# EAGLE schematic LaserScanner (EAGLE 9.1.3)
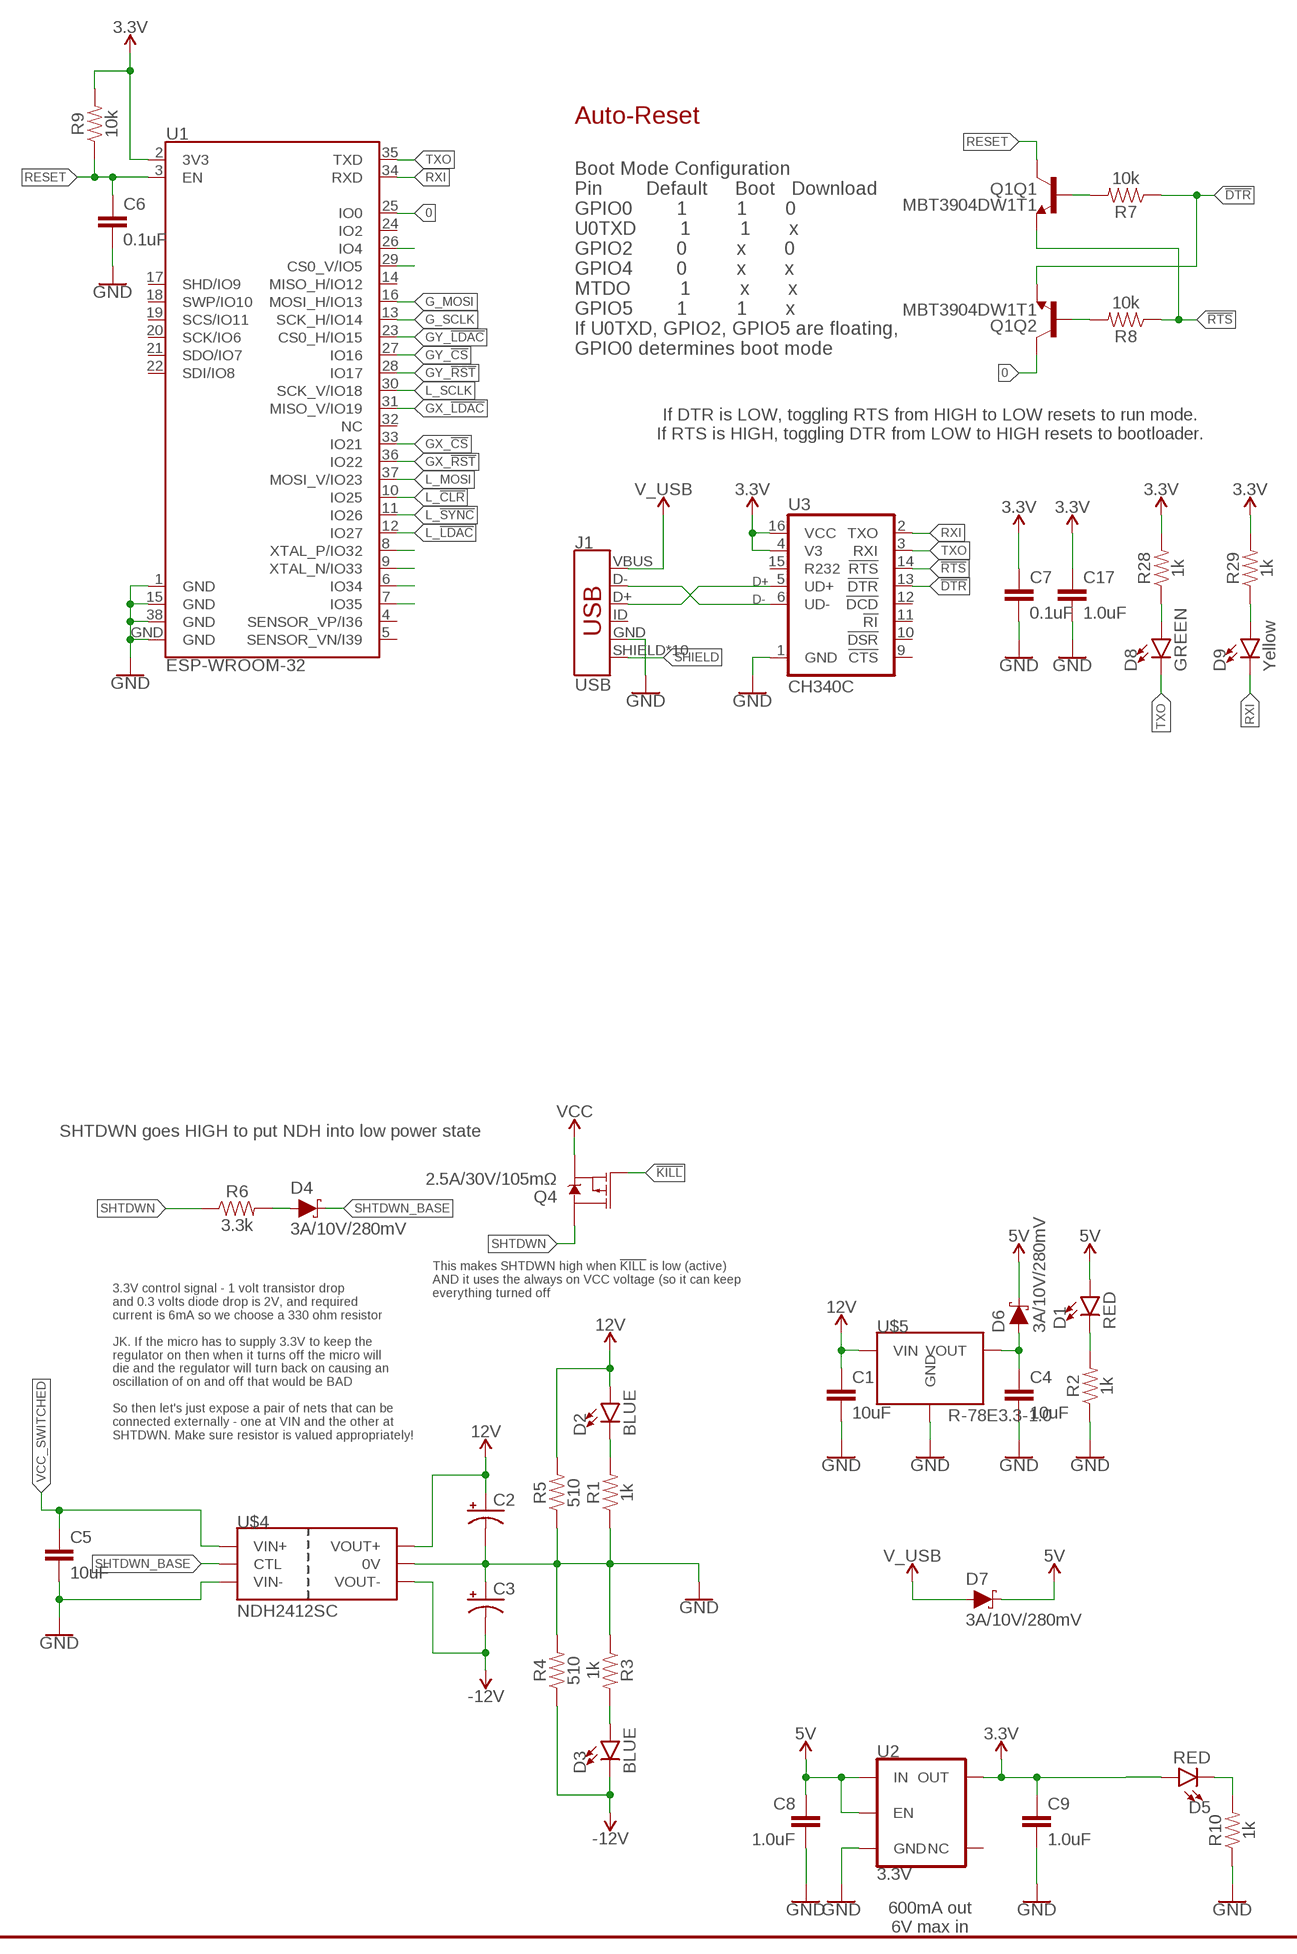
[diagram p0: schematic, sheet 1, part 1 of 2]
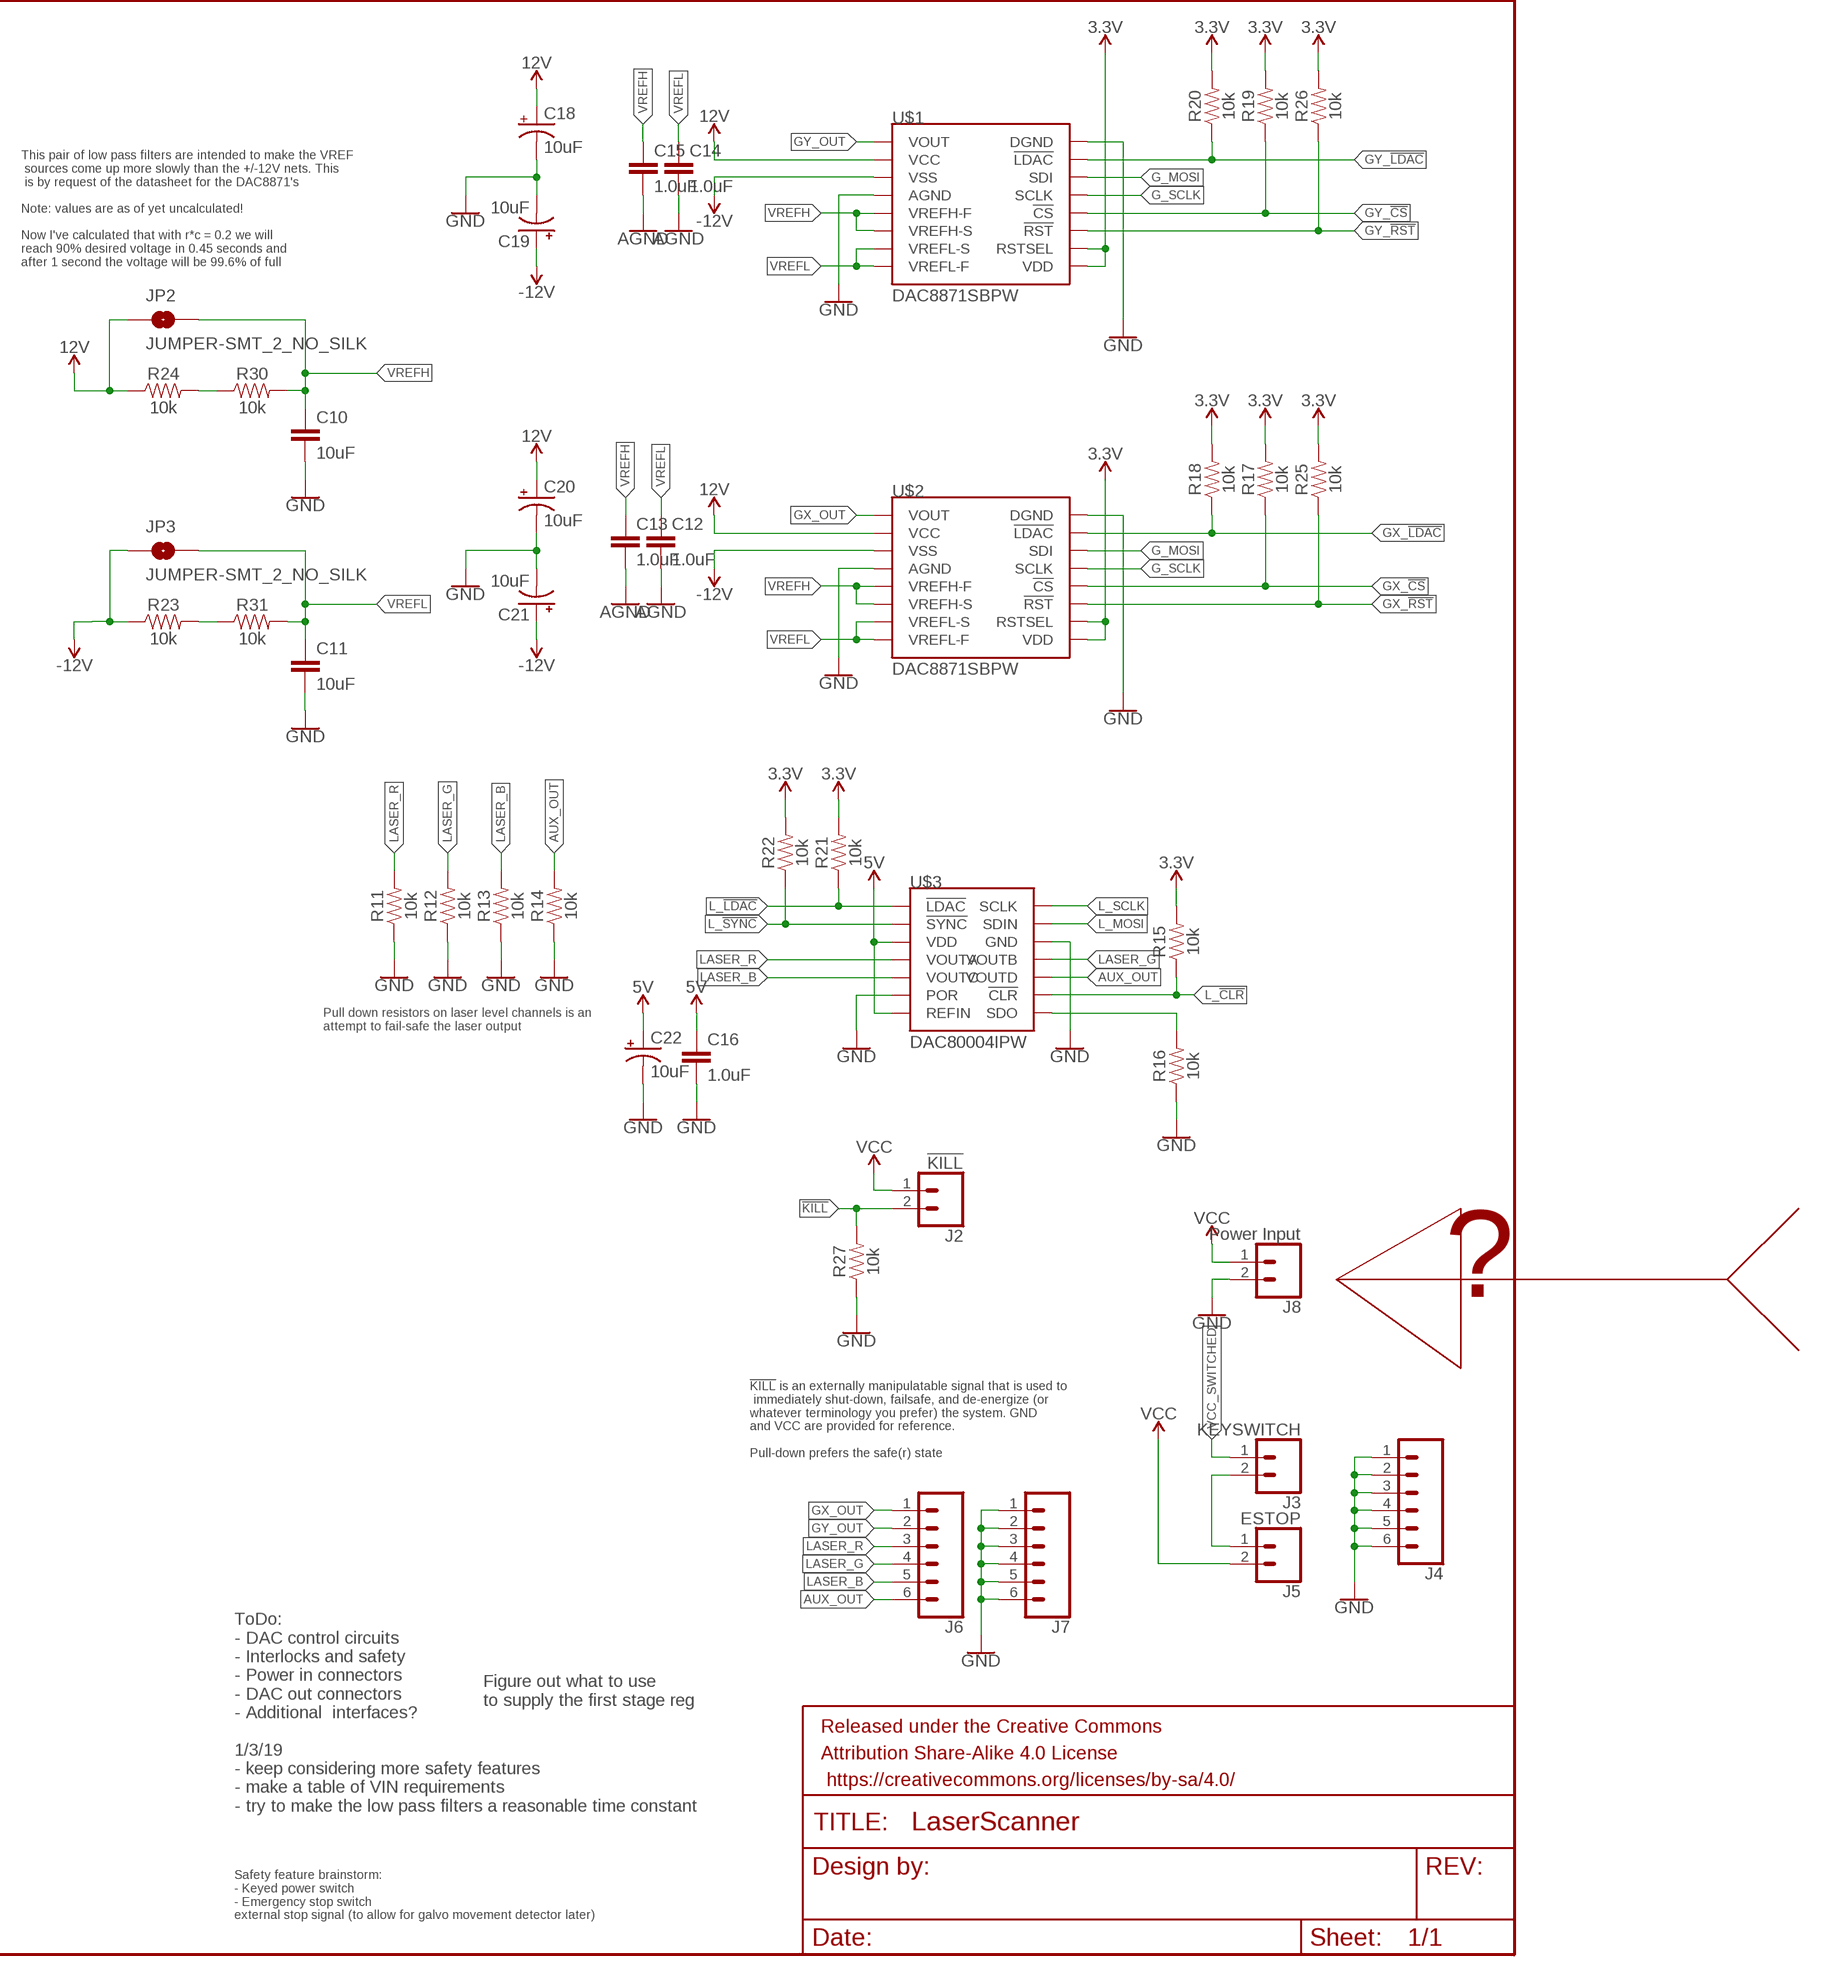
[diagram p1: schematic, sheet 1, part 2 of 2]

## Parts
C1  10uF  10UF-1210-50V-20%  [1210]
C2  47UF-POLAR-PANASONIC_D-50V-20%  [PANASONIC_D]
C3  47UF-POLAR-PANASONIC_D-50V-20%  [PANASONIC_D]
C4  10uF  10UF-1210-50V-20%  [1210]
C5  10uF  10UF-1210-50V-20%  [1210]
C6  0.1uF  0.1UF-0603-25V-(+80/-20%)  [0603]
C7  0.1uF  0.1UF-0603-25V-5%  [0603]
C8  1.0uF  1.0UF-0603-16V-10%  [0603]
C9  1.0uF  1.0UF-0603-16V-10%  [0603]
C10  10uF  10UF-1210-50V-20%  [1210]
C11  10uF  10UF-1210-50V-20%  [1210]
C12  1.0uF  1.0UF-0603-16V-10%-X7R  [0603]
C13  1.0uF  1.0UF-0603-16V-10%-X7R  [0603]
C14  1.0uF  1.0UF-0603-16V-10%-X7R  [0603]
C15  1.0uF  1.0UF-0603-16V-10%-X7R  [0603]
C16  1.0uF  1.0UF-0603-16V-10%-X7R  [0603]
C17  1.0uF  1.0UF-0603-16V-10%-X7R  [0603]
C18  10uF  10UF-POLAR-EIA3216-16V-10%(TANT)  [EIA3216]
C19  10uF  10UF-POLAR-EIA3216-16V-10%(TANT)  [EIA3216]
C20  10uF  10UF-POLAR-EIA3216-16V-10%(TANT)  [EIA3216]
C21  10uF  10UF-POLAR-EIA3216-16V-10%(TANT)  [EIA3216]
C22  10uF  10UF-POLAR-EIA3216-16V-10%(TANT)  [EIA3216]
D1  RED  LED-RED0603  [LED-0603]
D2  BLUE  LED-BLUE0603  [LED-0603]
D3  BLUE  LED-BLUE0603  [LED-0603]
D4  3A/10V/280mV  DIODE-SCHOTTKY-BAT60A  [SOD-323]
D5  RED  LED-RED0603  [LED-0603]
D6  3A/10V/280mV  DIODE-SCHOTTKY-BAT60A  [SOD-323]
D7  3A/10V/280mV  DIODE-SCHOTTKY-BAT60A  [SOD-323]
D8  GREEN  LED-GREEN0603  [LED-0603]
D9  Yellow  LED-YELLOW0603  [LED-0603]
FRAME1  FRAME-LEDGER  [CREATIVE_COMMONS]
J1  USB  USB_MICRO-B_HALF_PTH_MILL  [USB-MICROB-PTH-MILL]
J2  !KILL!  CONN_021X02_NO_SILK  [1X02_NO_SILK]
J3  KEYSWITCH  CONN_021X02_NO_SILK  [1X02_NO_SILK]
J4  CONN_06NO_SILK_FEMALE_PTH  [1X06_NO_SILK]
J5  ESTOP  CONN_021X02_NO_SILK  [1X02_NO_SILK]
J6  CONN_06NO_SILK_FEMALE_PTH  [1X06_NO_SILK]
J7  CONN_06NO_SILK_FEMALE_PTH  [1X06_NO_SILK]
J8  Power Input  CONN_021X02_NO_SILK  [1X02_NO_SILK]
JP2  JUMPER-SMT_2_NO_SILK  [SMT-JUMPER_2_NO_SILK]
JP3  JUMPER-SMT_2_NO_SILK  [SMT-JUMPER_2_NO_SILK]
Q1  MBT3904DW1T1  TRANS_NPN_DUAL-MBT3904DW1T1  [SC70-6]
Q4  2.5A/30V/105mΩ  MOSFET_PCH-DMG2307L  [SOT23-3]
R1  1k  1KOHM-0603-1/10W-1%  [0603]
R2  1k  1KOHM-0603-1/10W-1%  [0603]
R3  1k  1KOHM-0603-1/10W-1%  [0603]
R4  510  510OHM-2010-1/2W-5%  [2010]
R5  510  510OHM-2010-1/2W-5%  [2010]
R6  3.3k  3.3KOHM-0603-1/10W-1%  [0603]
R7  10k  10KOHM-0603-1/10W-1%  [0603]
R8  10k  10KOHM-0603-1/10W-1%  [0603]
R9  10k  10KOHM-0603-1/10W-1%  [0603]
R10  1k  1KOHM-0603-1/10W-1%  [0603]
R11  10k  10KOHM-0603-1/10W-1%  [0603]
R12  10k  10KOHM-0603-1/10W-1%  [0603]
R13  10k  10KOHM-0603-1/10W-1%  [0603]
R14  10k  10KOHM-0603-1/10W-1%  [0603]
R15  10k  10KOHM-0603-1/10W-1%  [0603]
R16  10k  10KOHM-0603-1/10W-1%  [0603]
R17  10k  10KOHM-0603-1/10W-1%  [0603]
R18  10k  10KOHM-0603-1/10W-1%  [0603]
R19  10k  10KOHM-0603-1/10W-1%  [0603]
R20  10k  10KOHM-0603-1/10W-1%  [0603]
R21  10k  10KOHM-0603-1/10W-1%  [0603]
R22  10k  10KOHM-0603-1/10W-1%  [0603]
R23  10k  10KOHM-0603-1/10W-1%  [0603]
R24  10k  10KOHM-0603-1/10W-1%  [0603]
R25  10k  10KOHM-0603-1/10W-1%  [0603]
R26  10k  10KOHM-0603-1/10W-1%  [0603]
R27  10k  10KOHM-0603-1/10W-1%  [0603]
R28  1k  1KOHM-0603-1/10W-1%  [0603]
R29  1k  1KOHM-0603-1/10W-1%  [0603]
R30  10k  10KOHM-0603-1/10W-1%  [0603]
R31  10k  10KOHM-0603-1/10W-1%  [0603]
U1  ESP-WROOM-32  [ESP-WROOM-32]
U2  3.3V  V_REG_AP2112K-3.3V  [SOT23-5]
U3  CH340C  [SO016]
U$1  DAC8871SBPW  [TSSOP16]
U$2  DAC8871SBPW  [TSSOP16]
U$3  DAC80004IPW  [TSSOP14]
U$4  NDH2412SC  [NDH]
U$5  R-78E3.3-1.0  [RE-78E]

## Nets
0: Q1.6(Q2:C) U1.25(IO0)
3.3V: C7.1 C9.1 C17.1 D5.A R9.2 R15.2 R17.2 R18.2 R19.2 R20.2 R21.2 R22.2 R25.2 R26.2 R28.2 R29.2 U1.2(3V3) U2.5(OUT) U3.4(V3) U3.16(VCC) U$1.9(VDD) U$1.10(RSTSEL) U$2.9(VDD) U$2.10(RSTSEL)
5V: C8.1 C16.1 C22.+ D1.A D6.C D7.C U2.1(IN) U2.3(EN) U$3.3(VDD) U$3.7(REFIN)
12V: C1.1 C2.+ C18.+ C20.+ D2.A JP2.1 R5.2 R24.1 U$1.2(VCC) U$2.2(VCC) U$4.6(VOUT+) U$5.1(VIN)
!DTR: Q1.1(Q2:E) R7.1 U3.13(!DTR)
!KILL: J2.2 Q4.1(G) R27.2
!RTS: Q1.4(Q1:E) R8.1 U3.14(!RTS)
-12V: C3.- C19.+ C21.+ D3.C JP3.1 R4.1 R23.1 U$1.3(VSS) U$2.3(VSS) U$4.9(VOUT-)
AGND: C12.2 C13.2 C14.2 C15.2
AUX_OUT: J6.6 R14.2 U$3.10(VOUTD)
D+: J1.D+ U3.5(UD+)
D-: J1.D- U3.6(UD-)
G_MOSI: U1.16(MOSI_H/IO13) U$1.14(SDI) U$2.14(SDI)
G_SCLK: U1.13(SCK_H/IO14) U$1.13(SCLK) U$2.13(SCLK)
GND: C1.2 C2.- C3.+ C4.2 C5.2 C6.2 C7.2 C8.2 C9.2 C10.2 C11.2 C16.2 C17.2 C18.- C19.- C20.- C21.- C22.- J1.GND J4.1 J4.2 J4.3 J4.4 J4.5 J4.6 J7.1 J7.2 J7.3 J7.4 J7.5 J7.6 J8.2 R1.1 R2.1 R3.1 R4.2 R5.1 R10.1 R11.1 R12.1 R13.1 R14.1 R16.1 R27.1 U1.1(GND) U1.15(GND) U1.38(GND) U1.GND U2.2(GND) U3.1(GND) U$1.4(AGND) U$1.16(DGND) U$2.4(AGND) U$2.16(DGND) U$3.6(POR) U$3.12(GND) U$4.1(VIN-) U$4.7(0V) U$5.2(GND)
GX_!CS: R17.1 U1.33(IO21) U$2.12(!CS)
GX_!LDAC: R18.1 U1.31(MISO_V/IO19) U$2.15(!LDAC)
GX_!RST: R25.1 U1.36(IO22) U$2.11(!RST)
GX_OUT: J6.1 U$2.1(VOUT)
GY_!CS: R19.1 U1.27(IO16) U$1.12(!CS)
GY_!LDAC: R20.1 U1.23(CS0_H/IO15) U$1.15(!LDAC)
GY_!RST: R26.1 U1.28(IO17) U$1.11(!RST)
GY_OUT: J6.2 U$1.1(VOUT)
L_!CLR: R15.1 U1.10(IO25) U$3.9(!CLR)
L_!LDAC: R21.1 U1.12(IO27) U$3.1(!LDAC)
L_!SYNC: R22.1 U1.11(IO26) U$3.2(!SYNC)
L_MOSI: U1.37(MOSI_V/IO23) U$3.13(SDIN)
L_SCLK: U1.30(SCK_V/IO18) U$3.14(SCLK)
LASER_B: J6.5 R13.2 U$3.5(VOUTC)
LASER_G: J6.4 R12.2 U$3.11(VOUTB)
LASER_R: J6.3 R11.2 U$3.4(VOUTA)
N$1: D1.C R2.2
N$2: R16.2 U$3.8(SDO)
N$3: D2.C R1.2
N$4: D4.A R6.2
N$5: D3.A R3.2
N$6: D5.C R10.2
N$7: C4.1 D6.A U$5.3(VOUT)
N$8: U1.26(IO4)
N$9: J3.2 J5.1
N$10: Q1.5(Q1:B) R7.2
N$11: U1.29(CS0_V/IO5)
N$12: Q1.2(Q2:B) R8.2
N$13: D8.A R28.1
N$14: D9.A R29.1
N$15: R24.2 R30.1
N$16: R23.2 R31.1
N$22: U1.8(XTAL_P/IO32)
N$23: U1.9(XTAL_N/IO33)
N$24: U1.6(IO34)
N$25: U1.7(IO35)
RESET: C6.1 Q1.3(Q1:C) R9.1 U1.3(EN)
RXI: D9.C U1.34(RXD) U3.2(TXO)
SHIELD: J1.SHIELD J1.SHIELD2(SHIELD) J1.SHIELD3(SHIELD) J1.SHIELD4(SHIELD) J1.SHIELD5(SHIELD) J1.SHIELD6(SHIELD) J1.SHIELD7(SHIELD) J1.SHIELD8(SHIELD) J1.SHIELD9(SHIELD) J1.SHIELD10(SHIELD)
SHTDWN: Q4.3(D) R6.1
SHTDWN_BASE: D4.C U$4.3(CTL)
TXO: D8.C U1.35(TXD) U3.3(RXI)
V_USB: D7.A J1.VBUS
VCC: J2.1 J5.2 J8.1 Q4.2(S)
VCC_SWITCHED: C5.1 J3.1 U$4.2(VIN+)
VREFH: C10.1 C13.1 C15.1 JP2.2 R30.2 U$1.5(VREFH-F) U$1.6(VREFH-S) U$2.5(VREFH-F) U$2.6(VREFH-S)
VREFL: C11.1 C12.1 C14.1 JP3.2 R31.2 U$1.7(VREFL-S) U$1.8(VREFL-F) U$2.7(VREFL-S) U$2.8(VREFL-F)
Unconnected: J1.ID U1.4(SENSOR_VP/I36) U1.5(SENSOR_VN/I39) U1.14(MISO_H/IO12) U1.17(SHD/IO9) U1.18(SWP/IO10) U1.19(SCS/IO11) U1.20(SCK/IO6) U1.21(SDO/IO7) U1.22(SDI/IO8) U1.24(IO2) U1.32(NC) U2.4(NC) U3.9(!CTS) U3.10(!DSR) U3.11(!RI) U3.12(!DCD) U3.15(R232)

## Notes on the sheet
- Auto-Reset
- This pair of low pass filters are intended to make the VREF
   sources come up more slowly than the +/-12V nets. This
   is by request of the datasheet for the DAC8871's
  
  Note: values are as of yet uncalculated!
  
  Now I've calculated that with r*c = 0.2 we will 
  reach 90% desired voltage in 0.45 seconds and 
  after 1 second the voltage will be 99.6% of full
- Boot Mode Configuration
  Pin        Default     Boot   Download
  GPIO0        1         1       0
  U0TXD        1         1       x
  GPIO2        0         x       0
  GPIO4        0         x       x
  MTDO         1         x       x
  GPIO5        1         1       x
  If U0TXD, GPIO2, GPIO5 are floating, 
  GPIO0 determines boot mode
- If DTR is LOW, toggling RTS from HIGH to LOW resets to run mode.
  If RTS is HIGH, toggling DTR from LOW to HIGH resets to bootloader.
- Pull down resistors on laser level channels is an 
  attempt to fail-safe the laser output
- SHTDWN goes HIGH to put NDH into low power state
- ?
- This makes SHTDWN high when !KILL! is low (active)
  AND it uses the always on VCC voltage (so it can keep 
  everything turned off
- 3.3V control signal - 1 volt transistor drop 
  and 0.3 volts diode drop is 2V, and required 
  current is 6mA so we choose a 330 ohm resistor
  
  JK. If the micro has to supply 3.3V to keep the 
  regulator on then when it turns off the micro will 
  die and the regulator will turn back on causing an 
  oscillation of on and off that would be BAD
  
  So then let's just expose a pair of nets that can be 
  connected externally - one at VIN and the other at 
  SHTDWN. Make sure resistor is valued appropriately!
- !KILL! is an externally manipulatable signal that is used to
   immediately shut-down, failsafe, and de-energize (or 
  whatever terminology you prefer) the system. GND 
  and VCC are provided for reference.
  
  Pull-down prefers the safe(r) state
- Figure out what to use
  to supply the first stage reg
- ToDo: 
  - DAC control circuits
  - Interlocks and safety
  - Power in connectors
  - DAC out connectors
  - Additional  interfaces?
  
  1/3/19
  - keep considering more safety features
  - make a table of VIN requirements
  - try to make the low pass filters a reasonable time constant
- 600mA out
  6V max in
- Safety feature brainstorm:
  - Keyed power switch
  - Emergency stop switch
  external stop signal (to allow for galvo movement detector later)

## Library data of the parts
C1 C4 C5 C10 C11 = SparkFun-Capacitors:10UF: 10.0µF ceramic capacitors A capacitor is a passive two-terminal electrical component used to store electrical energy temporarily in an electric field.; PROD_ID: CAP-09824
C2 C3 = SparkFun-Capacitors:47UF-POLAR: 47µF polarized capacitors A capacitor is a passive two-terminal electrical component used to store electrical energy temporarily in an electric field.
C6 = SparkFun-Capacitors:0.1UF: 0.1µF ceramic capacitors A capacitor is a passive two-terminal electrical component used to store electrical energy temporarily in an electric field.; PROD_ID: CAP-00810
C7 = SparkFun-Capacitors:0.1UF: 0.1µF ceramic capacitors A capacitor is a passive two-terminal electrical component used to store electrical energy temporarily in an electric field.; PROD_ID: CAP-08604
C8 C9 = SparkFun-Capacitors:1.0UF: 1µF ceramic capacitors A capacitor is a passive two-terminal electrical component used to store electrical energy temporarily in an electric field.; PROD_ID: CAP-00868
C12-C17 = SparkFun-Capacitors:1.0UF: 1µF ceramic capacitors A capacitor is a passive two-terminal electrical component used to store electrical energy temporarily in an electric field.; PROD_ID: CAP-13930
C18-C22 = SparkFun-Capacitors:10UF-POLAR: 10.0µF polarized capacitors A capacitor is a passive two-terminal electrical component used to store electrical energy temporarily in an electric field.; PROD_ID: CAP-00811
D1 D5 = SparkFun-LED:LED-RED: Red SMD LED Used in manufacturing of most products at SparkFun Packages: 0603 - SMD 0603 package [Product Link] <http://docs.avagotech.com/docs/AV02-0551EN> 0603 SMART - SMD 0603 SMART package ( more efficient and expensive)[Product Link] <http://www.osram-os.com/Graphics/XPic2/00077099_0.pdf> 1206 - SMD1206 package [Product Link] <https://www.sparkfun.com/datasheets/DevTools/LilyPad/Q150OVS4.pdff> SparkFun Products: Pro Mini 328 -5V <https://www.sparkfun.com/products/821> RedBoard <https://www.sparkfun.com/products/12757> IOIO-OTG <https://www.sparkfun.com/products/13613>; PROD_ID: DIO-00819
D2 D3 = SparkFun-LED:LED-BLUE: Blue SMD LED Used in manufacturing of various products at SparkFun Packages: 0603 - SMD 0603 package [Product Link] <http://www.digikey.com/product-detail/en/SMLE12BC7TT86/511-1589-2-ND/1641808> 1206 - SMD1206 package [Product Link] <http://www.digikey.com/product-detail/en/lite-on-inc/LTST-C150TBKT/160-1643-1-ND/573584> SparkFun Products: ESP8266 Thing-Dev Board <https://www.sparkfun.com/products/13711> RedBoard <https://www.sparkfun.com/products/12757>; PROD_ID: DIO-08575
D4 D6 D7 = SparkFun-DiscreteSemi:DIODE-SCHOTTKY: Schottky diode A Schottky diode is a semiconductor diode which has a low forward voltage drop and a very fast switching action.; PROD_ID: DIO-14072
D8 = SparkFun-LED:LED-GREEN: Green SMD LED Used in manufacturing of various products at SparkFun Packages: 0603 - SMD 0603 package [Product Link] <http://www.futureelectronics.com/en/technologies/semiconductors/optoelectronics/leds/Pages/9894312-LTST-C190GKT.aspx?CrossPart=HSMG-C190&IM=0> LilyPad 1206 - SMD1206 LilyPad package [Product Link] <http://www.futureelectronics.com/en/Technologies/Product.aspx?ProductID=IN150NGHARVATEKCORPORATION2049943&IM=0> 1206 - SMD1206 package [Product Link] <http://www.futureelectronics.com/en/technologies/semiconductors/optoelectronics/leds/Pages/8315665-LTST-C150KGKT.aspx?IM=0> 1206 Bottom Mount -SMD 1206 Bottom Mount [Product Link] <http://www.digikey.com/product-detail/en/lite-on-inc/LTST-C230KGKT/160-1456-1-ND/386854> SparkFun Products: Pro Mini 328 -5V <https://www.sparkfun.com/products/821> RedBoard <https://www.sparkfun.com/products/12757> MP3 Trigger <https://www.sparkfun.com/products/13720> Makey Makey <https://www.sparkfun.com/products/11076>; PROD_ID: DIO-00821
D9 = SparkFun-LED:LED-YELLOW: Yellow SMD LED Used in manufacturing several products at SparkFun. Packages: 0603 - SMD 0603 package[Product Link] <http://www.kingbrightusa.com/product.asp?catalog_name=LED&product_id=APT1608SYCK> 0603 -SMART - SMART SMD 0603 package (more efficient/more expensive) [Product Link] <http://www.osram-os.com/osram_os/en/products/product-catalog/led-light-emitting-diodes/smartled-0603/ly-l29k/index.jsp> LilyPad - SMD1206 package[Product Datasheet] <https://www.sparkfun.com/datasheets/DevTools/LilyPad/Q150YUS4.pdf> SparkFun Products: Blynk Board <https://www.sparkfun.com/products/13794> IOIO-OTG <https://www.sparkfun.com/products/13613> XBee Explorer Serial <https://www.sparkfun.com/products/13225>; PROD_ID: DIO-09003
FRAME1 = SparkFun-Aesthetics:FRAME-LEDGER: Schematic Frame - Ledger Standard 11x14 US Ledger frame
J1 = SparkFun-Connectors:USB_MICRO-B: USB Type Micro-B Connector Male/female and PTH/SMT variants SparkFun Products: SparkFun microB USB Breakout <https://www.sparkfun.com/products/12035> SparkFun USB microB Plug Breakout <https://www.sparkfun.com/products/10031> SparkFun ESP8266 Thing <https://www.sparkfun.com/products/13231>; PROD_ID: CONN-13711
J2 J3 J5 J8 = SparkFun-Connectors:CONN_02: Multi connection point. Often used as Generic Header-pin footprint for 0.1 inch spaced/style header connections On any of the 0.1 inch spaced packages, you can populate with these: Break Away Headers - Straight <https://www.sparkfun.com/products/116> (PRT-00116) Break Away Male Headers - Right Angle <https://www.sparkfun.com/products/553> (PRT-00553) Female Headers <https://www.sparkfun.com/products/115> (PRT-00115) Break Away Headers - Machine Pin <https://www.sparkfun.com/products/117> (PRT-00117) Break Away Female Headers - Swiss Machine Pin <https://www.sparkfun.com/products/743> (PRT-00743) For SCREWTERMINALS and SPRING TERMINALS visit here: Screw Terimnals on SparkFun.com <https://www.sparkfun.com/search/results?term=Screw+Terminals> (5mm/3.5mm/2.54mm spacing) This device is also useful as a general connection point to wire up your design to another part of your project. Our various solder wires solder well into these plated through hole pads. Hook-Up Wire - Assortment (Stranded, 22 AWG) <https://www.sparkfun.com/products/11375> (PRT-11375) Hook-Up Wire - Assortment (Solid Core, 22 AWG) <https://www.sparkfun.com/products/11367> (PRT-11367) View the entire wire category on our website here <https://www.sparkfun.com/categories/141> Special notes: Molex polarized connector foot print use with: PRT-08233 with associated crimp pins and housings. 2.54_SCREWTERM for use with PRT-10571. 3.5mm Screw Terminal footprints for PRT-08084 5mm Screw Terminal footprints for use with PRT-08432
J4 J6 J7 = SparkFun-Connectors:CONN_06: Multi connection point. Often used as Generic Header-pin footprint for 0.1 inch spaced/style header connections On any of the 0.1 inch spaced packages, you can populate with these: Break Away Headers - Straight <https://www.sparkfun.com/products/116> (PRT-00116) Break Away Male Headers - Right Angle <https://www.sparkfun.com/products/553> (PRT-00553) Female Headers <https://www.sparkfun.com/products/115> (PRT-00115) Break Away Headers - Machine Pin <https://www.sparkfun.com/products/117> (PRT-00117) Break Away Female Headers - Swiss Machine Pin <https://www.sparkfun.com/products/743> (PRT-00743) Arduino Stackable Header - 6 Pin <https://www.sparkfun.com/products/9280> (PRT-09280) For SCREWTERMINALS and SPRING TERMINALS visit here: Screw Terimnals on SparkFun.com <https://www.sparkfun.com/search/results?term=Screw+Terminals> (5mm/3.5mm/2.54mm spacing) This device is also useful as a general connection point to wire up your design to another part of your project. Our various solder wires solder well into these plated through hole pads. Hook-Up Wire - Assortment (Stranded, 22 AWG) <https://www.sparkfun.com/products/11375> (PRT-11375) Hook-Up Wire - Assortment (Solid Core, 22 AWG) <https://www.sparkfun.com/products/11367> (PRT-11367) View the entire wire category on our website here <https://www.sparkfun.com/categories/141>; PROD_ID: CONN-08437
JP2 JP3 = SparkFun-Jumpers:JUMPER-SMT_2_NO: Normally open jumper This jumper has two pads in close proximity to each other. Apply solder to close the connection. Round pads are easier to solder for beginners, but are a lot larger. SparkFun Product that uses the round pads: SparkFun EL Sequencer <https://www.sparkfun.com/products/12781>
Q1 = SparkFun-DiscreteSemi:TRANS_NPN_DUAL: Dual NPN Transistors in Single Package The MBT3904W1 puts two general purpose 3904 NPN transistors in a single package. Datasheet <http://www.onsemi.com/pub_link/Collateral/MBT3904DW1T1-D.PDF> SparkFun Products: SparkFun ESP32 Thing <https://www.sparkfun.com/products/13907>; PROD_ID: TRANS-13337
Q4 = SparkFun-DiscreteSemi:MOSFET_PCH: P-channel MOSFETs Voltage controlled devices that allow control of high current outputs. SparkFun Products: SparkFun ESP32 Thing <https://www.sparkfun.com/products/13907> SparkFun ESP8266 Thing <https://www.sparkfun.com/products/13231>; PROD_ID: TRANS-11308
R1-R3 R10 R28 R29 = SparkFun-Resistors:1KOHM: 1kΩ resistor A resistor is a passive two-terminal electrical component that implements electrical resistance as a circuit element. Resistors act to reduce current flow, and, at the same time, act to lower voltage levels within circuits. - Wikipedia; PROD_ID: RES-07856
R4 R5 = SparkFun-Resistors:510OHM: 510Ω resistor A resistor is a passive two-terminal electrical component that implements electrical resistance as a circuit element. Resistors act to reduce current flow, and, at the same time, act to lower voltage levels within circuits. - Wikipedia; PROD_ID: RES-08717
R6 = SparkFun-Resistors:3.3KOHM: 3.3kΩ resistor A resistor is a passive two-terminal electrical component that implements electrical resistance as a circuit element. Resistors act to reduce current flow, and, at the same time, act to lower voltage levels within circuits. - Wikipedia; PROD_ID: RES-07851
R7-R9 R11-R27 R30 R31 = SparkFun-Resistors:10KOHM: 10kΩ resistor A resistor is a passive two-terminal electrical component that implements electrical resistance as a circuit element. Resistors act to reduce current flow, and, at the same time, act to lower voltage levels within circuits. - Wikipedia; PROD_ID: RES-00824
U1 = SparkFun-RF:ESP-WROOM-32; PROD_ID: IC-13849
U2 = SparkFun-IC-Power:V_REG_AP2112: AP2112 - 600mA CMOS LDO Regulator w/ Enable The AP2112 is CMOS process low dropout linear regulator with enable function, the regulator delivers a guaranteed 600mA (min.) continuous load current. Features Output Voltage Accuracy: ±1.5% Output Current: 600mA (Min.) Foldback Short Current Protection: 50mA Enable Function to Turn ON/OFF VOUT Low Dropout Voltage (3.3V): 250mV (Typ.) @IOUT=600mA Excellent Load Regulation: 0.2%/A (Typ.) Excellent Line Regulation: 0.02%/V (Typ.) Low Quiescent Current: 55μA (Typ.) Low Standby Current: 0.01μA (Typ.) Low Output Noise: 50μVRMS PSRR: 100Hz -65dB, 1kHz -65dB OTSD Protection Stable with 1.0μF Flexible Cap: Ceramic, Tantalum and Aluminum Electrolytic Operation Temperature Range: -40°C to 85°C ESD: MM 400V, HBM 4000V; PROD_ID: VREG-12457
U3 = SparkFun-IC-Comms:CH340C; PROD_ID: IC-14038
U$1 U$2 = laserscanner:DAC8871SBPW
U$3 = laserscanner:DAC80004IPW
U$4 = laserscanner:NDH2412SC
U$5 = laserscanner:R-78E3.3-1.0

## Net classes
0 default: width 0.152 mm, drill 0.305 mm